# EAGLE design netSpeed (EAGLE 6.3)
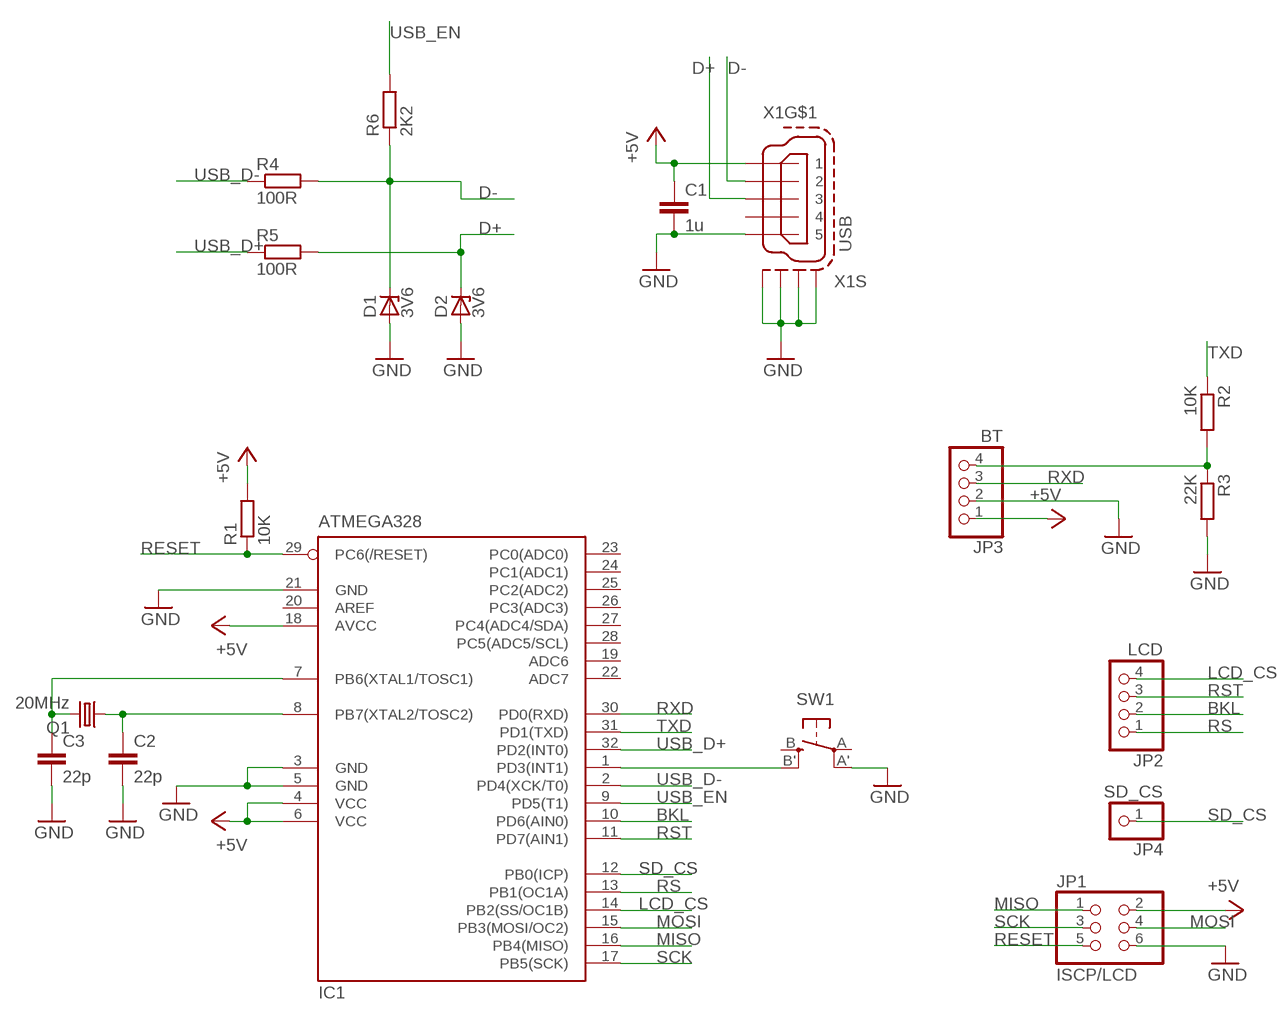
[diagram p0: schematic, sheet 1]

## Parts
C1  1u  C-EUC0805  [C0805]
C2  22p  C-EUC0805  [C0805]
C3  22p  C-EUC0805  [C0805]
D1  3V6  ZENER-DIODEZD-2.5  [ZDIO-2.5]
D2  3V6  ZENER-DIODEZD-2.5  [ZDIO-2.5]
IC1  ATMEGA328  MEGA8-AI  [TQFP32-08]
JP1  ISCP/LCD  PINHD-2X3  [2X03]
JP2  LCD  PINHD-1X4  [1X04]
JP3  BT  PINHD-1X4  [1X04]
JP4  SD_CS  PINHD-1X1  [1X01]
Q1  20MHz  CRYSTALHC49UP  [HC49UP]
R1  10K  R-EU_M0805  [M0805]
R2  10K  R-EU_M0805  [M0805]
R3  22K  R-EU_M0805  [M0805]
R4  100R  R-EU_M0805  [M0805]
R5  100R  R-EU_M0805  [M0805]
R6  2K2  R-EU_M0805  [M0805]
SW1  SPST_TACT-EVQQ2  [EVQ-Q2]
X1  USB  MINI-USB-SCHIELD-32005-201  [32005-201]

## Nets
+5V: C1.1 IC1.4(VCC) IC1.6(VCC) IC1.18(AVCC) JP1.2 JP3.1 R1.2 X1.1
BKL: IC1.10(PD6(AIN0)) JP2.2
D+: D2.C R5.2 X1.3
D-: D1.C R4.2 R6.1 X1.2
GND: C1.2 C2.2 C3.2 D1.A D2.A IC1.3(GND) IC1.5(GND) IC1.21(GND) JP1.6 JP3.2 R3.2 SW1.A'(P1) X1.5 X1.M1(S:S1) X1.M2(S:S2) X1.M3(S:S3) X1.M4(S:S4)
LCD_CS: IC1.14(PB2(SS/OC1B)) JP2.4
MISO: IC1.16(PB4(MISO)) JP1.1
MOSI: IC1.15(PB3(MOSI/OC2)) JP1.4
N$1: IC1.1(PD3(INT1)) SW1.B'(S1)
N$2: JP3.4 R2.2 R3.1
N$4: C2.1 IC1.8(PB7(XTAL2/TOSC2)) Q1.1
N$5: C3.1 IC1.7(PB6(XTAL1/TOSC1)) Q1.2
RESET: IC1.29(PC6(/RESET)) JP1.5 R1.1
RS: IC1.13(PB1(OC1A)) JP2.1
RST: IC1.11(PD7(AIN1)) JP2.3
RXD: IC1.30(PD0(RXD)) JP3.3
SCK: IC1.17(PB5(SCK)) JP1.3
SD_CS: IC1.12(PB0(ICP)) JP4.1
TXD: IC1.31(PD1(TXD)) R2.1
USB_D+: IC1.32(PD2(INT0)) R5.1
USB_D-: IC1.2(PD4(XCK/T0)) R4.1
USB_EN: IC1.9(PD5(T1)) R6.2
Unconnected: IC1.19(ADC6) IC1.20(AREF) IC1.22(ADC7) IC1.23(PC0(ADC0)) IC1.24(PC1(ADC1)) IC1.25(PC2(ADC2)) IC1.26(PC3(ADC3)) IC1.27(PC4(ADC4/SDA)) IC1.28(PC5(ADC5/SCL)) SW1.A(P) SW1.B(S) X1.4

## Library data of the parts
C1-C3 = resistor:C-EU: CAPACITOR, European symbol
D1 D2 = diode:ZENER-DIODE: Z-Diode
IC1 = atmel:MEGA8: MICROCONTROLLER 8 Kbytes FLASH, 1 kbytes SRAM, 512 bytes EEPROM, USART, 6-channel 10 bit ADC, 2-channel 8 bit ADC Pin compatible with Atmega48, ATMega88, ATMega168 Source: avr.lbr; MPN: ATMEGA8-16AU; OC_FARNELL: 9171371; OC_NEWARK: 73M8863
JP1 = pinhead:PINHD-2X3: PIN HEADER
JP2 JP3 = pinhead:PINHD-1X4: PIN HEADER
JP4 = pinhead:PINHD-1X1: PIN HEADER
Q1 = crystal:CRYSTAL: CRYSTAL; OC_FARNELL: unknown; OC_NEWARK: unknown
R1-R6 = resistor:R-EU_: RESISTOR, European symbol
SW1 = adafruit:SPST_TACT: SMT 6mm switch, EVQQ2 series http://www.ladyada.net/library/eagle
X1 = con-cypressindustries:MINI-USB-SCHIELD-: MINI USB-B Conector Source: www.cypressindustries.com; OC_FARNELL: unknown; OC_NEWARK: unknown

## Board
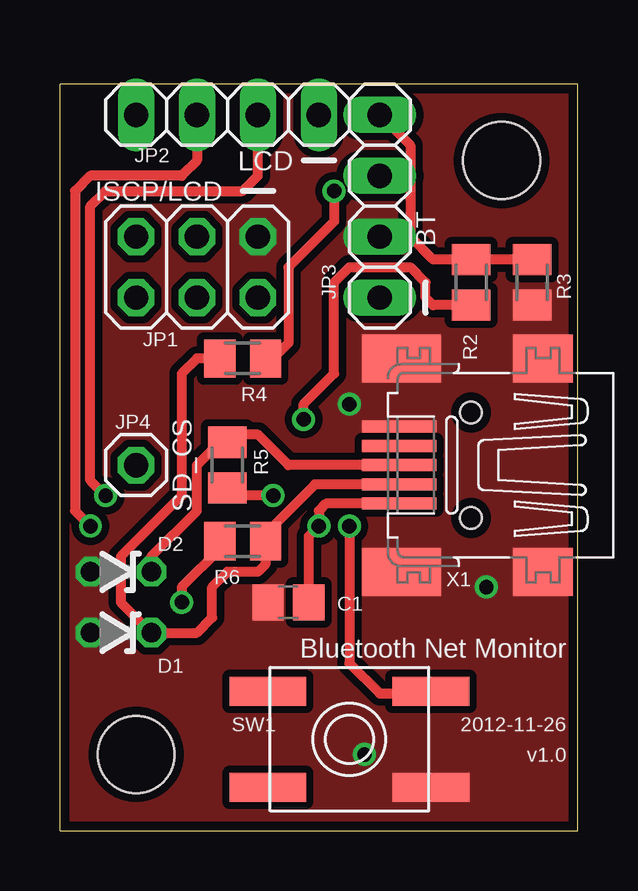
[diagram p1: board, top side]
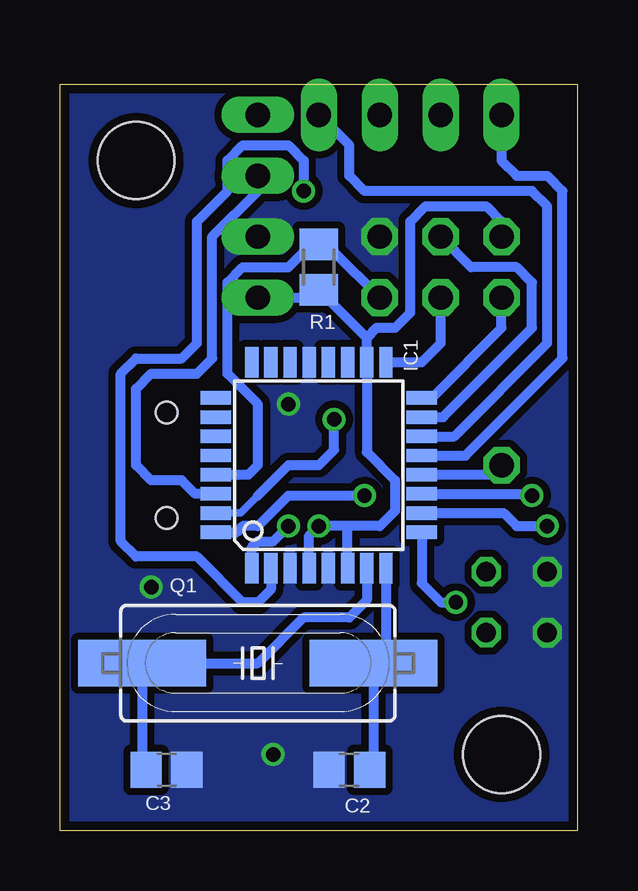
[diagram p2: board, bottom side, seen from below]

Size 21.59 x 31.11 mm. Coordinates in mm from the lower left corner, seen from the top.
Outline: 0,0 21.59,0 21.59,31.11 0,31.11 0,0
Copper layers (1*16): Top 0.0356mm / dielectric 1.5011mm / Bottom 0.0356mm
Design rules "default": minimum track width 6mil, minimum drill 13mil, track to track 6mil, track to pad 6mil, pad to pad 6mil, via to via 6mil, smd to smd 6mil, copper to edge 15mil, drill to drill 6mil, minimum pad ring 7mil, minimum via ring 7mil, stop-mask expansion 4mil, vias tented up to drill 0mil, thermal gap 10mil
Holes 3.2 mm at 18.41,27.94 3.17,3.17

### Footprints (pad centres in the part's own frame; a part is rotated, then mirrored left to right if it is on the bottom)
C0805 = smd 1.3 x 1.5: 1 -0.85,0; 2 0.85,0
ZDIO-2.5 = drill 0.813 octagon: A 1.27,0; C -1.27,0
TQFP32-08 = smd 1.27 x 0.559: 1 -4.293,2.8; 2 -4.293,2; 3 -4.293,1.2; 4 -4.293,0.4; 5 -4.293,-0.4; 6 -4.293,-1.2; 7 -4.293,-2; 8 -4.293,-2.8; 17 4.293,-2.8; 18 4.293,-2; 19 4.293,-1.2; 20 4.293,-0.4; 21 4.293,0.4; 22 4.293,1.2; 23 4.293,2; 24 4.293,2.8 | smd 0.559 x 1.27: 9 -2.8,-4.293; 10 -2,-4.293; 11 -1.2,-4.293; 12 -0.4,-4.293; 13 0.4,-4.293; 14 1.2,-4.293; 15 2,-4.293; 16 2.8,-4.293; 25 2.8,4.293; 26 2,4.293; 27 1.2,4.293; 28 0.4,4.293; 29 -0.4,4.293; 30 -1.2,4.293; 31 -2,4.293; 32 -2.8,4.293
2X03 = drill 1.016 octagon: 1 -2.54,-1.27; 2 -2.54,1.27; 3 0,-1.27; 4 0,1.27; 5 2.54,-1.27; 6 2.54,1.27
1X04 = drill 1.016 long: 1 -3.81,0; 2 -1.27,0; 3 1.27,0; 4 3.81,0
1X01 = drill 1.016 octagon: 1 0,0
HC49UP = smd 5.334 x 1.93: 1 -4.826,0; 2 4.826,0
M0805 = smd 1.3 x 1.6: 1 -0.95,0; 2 0.95,0
EVQ-Q2 = smd 3.2 x 1.2: A -3.4,-2; A' 3.4,-2; B -3.4,2; B' 3.4,2
32005-201 = smd 3.1 x 0.5: 1 3,1.6; 2 3,0.8; 3 3,0; 4 3,-0.8; 5 3,-1.6 | smd 2.5 x 2: M1 -3,-4.45; M2 -3,4.45 | smd 3.3 x 2: M3 2.9,4.45; M4 2.9,-4.45 | hole 0.9: 0,2.2; 0,-2.2

### Placement (x,y rotation side)
C1  9.53,9.53 180 top
C2  9.53,2.54 180 bottom
C3  17.14,2.54 0 bottom
D1  2.54,8.26 180 top
D2  2.54,10.79 180 top
IC1  10.79,15.24 90 bottom
JP1  5.71,23.5 0 top
JP2  6.99,29.84 0 top
JP3  13.34,26.04 90 top
JP4  3.17,15.24 0 top
Q1  13.34,6.99 180 bottom
R1  10.79,23.5 270 bottom
R2  17.14,22.86 90 top
R3  19.68,22.86 270 top
R4  7.62,19.68 180 top
R5  6.99,15.24 90 top
R6  7.62,12.06 180 top
SW1  12.06,3.81 0 top
X1  17.14,15.24 180 top

### Tracks (layer width: path | path; a pad name or v marks a point on that pad's centre or on a via)
+5V  (via drill 0.6)
  Top 0.406: X1.1 11.1,13.64 10.79,13.34 v10.79,12.7 10.38,12.28 C1.1
  Bottom 0.406: IC1.4 11.2,12.3 v10.79,12.7 9.53,12.7 | IC1.6 9.6,12.63 9.53,12.7 | 8.79,20.55 IC1.18 8.79,15.78 7.62,14.61 7.62,13.34 8.26,12.7 9.53,12.7 | 8.79,20.55 R1.2 11.12,22.23 JP3.1 | 8.79,20.55 8.38,20.95 7.62,20.95 6.99,21.59 6.99,25.4 6.35,26.04 3.81,26.04 3.17,25.4 JP1.2
BKL  (via drill 0.6)
  Top 0.406: JP2.2 5.71,27.94 5.08,27.3 1.27,27.3 0.64,26.67 0.64,13.34 v1.27,12.7
  Bottom 0.406: IC1.10 3.08,13.24 2.54,12.7 v1.27,12.7
D+
  Top 0.406: D2.C 3.81,11.43 5.71,13.34 5.71,15.24 6.35,15.88 6.67,15.88 R5.2 7.3,16.51 8.26,16.51 9.53,15.24 X1.3
D-
  Top 0.406: X1.2 10.63,14.44 8.57,12.38 R6.1 8.57,11.11 8.26,10.79 6.99,10.79 6.35,10.16 6.35,8.89 5.71,8.26 D1.C 2.54,9.53 2.54,11.43 5.08,13.97 5.08,19.05 5.71,19.68 R4.2
GND  (via drill 0.6)
  other vias: 17.78,10.16 12.7,3.17 12.06,17.78
  pour Top (isolate 0.305, no thermals): 0,31.11 21.59,31.11 21.59,0 0,0
  pour Bottom (isolate 0.305, no thermals): 0,31.11 21.59,31.11 21.59,0 0,0
LCD_CS
  Bottom 0.406: IC1.14 5.15,16.44 1.27,20.32 1.27,26.04 1.91,26.67 8.89,26.67 9.53,27.3 9.53,28.57 JP2.4
MISO
  Bottom 0.406: IC1.16 6.09,18.04 3.17,20.95 JP1.1
MOSI
  Bottom 0.406: JP1.4 4.45,23.5 2.54,23.5 1.91,22.86 1.91,20.95 5.62,17.24 IC1.15
N$1  (via drill 0.6)
  Top 0.406: v12.06,12.7 12.06,6.99 13.34,5.71 15.37,5.71 SW1.B'
  Bottom 0.406: IC1.1 13.6,11.8 13.34,12.06 12.7,12.06 v12.06,12.7
N$2
  Top 0.406: JP3.4 14.61,28.57 14.61,24.77 15.56,23.81 R2.2 R3.1
N$4
  Bottom 0.406: IC1.8 8,7.5 Q1.1 8.51,2.71 C2.1
N$5
  Bottom 0.406: IC1.7 8.79,9.62 9.53,8.89 11.43,8.89 13.34,6.99 Q1.2 18.16,2.71 C3.1
RESET
  Bottom 0.406: IC1.29 13.73,14.84 13.34,15.24 13.34,17.78 14.61,19.05 14.61,22.86 13.97,23.5 12.06,23.5 11.43,24.13 11.11,24.13 R1.1 10.48,24.13 10.16,24.13 JP1.5
RS
  Bottom 0.406: JP2.1 3.17,27.94 2.54,27.3 1.27,27.3 0.64,26.67 0.64,19.68 4.68,15.64 IC1.13
RST  (via drill 0.6)
  Top 0.406: JP2.3 8.26,27.3 7.62,26.67 1.91,26.67 1.27,26.04 1.27,14.61 v1.91,13.97
  Bottom 0.406: IC1.11 1.98,14.04 v1.91,13.97
RXD
  Bottom 0.406: IC1.30 15.95,14.04 16.51,14.61 17.78,14.61 18.41,15.24 18.41,18.41 17.78,19.05 15.88,19.05 15.24,19.68 15.24,24.77 13.34,26.67 JP3.3
SCK
  Bottom 0.406: IC1.17 6.5,19.53 5.71,20.32 JP1.3
SD_CS
  Bottom 0.406: IC1.12 3.58,14.84 JP4.1
TXD  (via drill 0.6)
  Top 0.406: R2.1 15.55,21.91 15.24,22.23 15.24,22.86 14.61,23.5 12.06,23.5 11.43,22.86 11.43,19.05 10.16,17.78 v10.16,17.14
  Bottom 0.305: IC1.31 14.06,13.24 13.34,13.97
  Bottom 0.406: 13.34,13.97 12.06,15.24 10.79,15.24 10.16,15.88 v10.16,17.14
USB_D+  (via drill 0.6)
  Top 0.406: v8.89,13.97 7.3,13.97 R5.1
  Bottom 0.406: v8.89,13.97 12.06,13.97 13.34,12.7 13.97,12.7 14.23,12.44 IC1.32
USB_D-  (via drill 0.6)
  Top 0.406: v11.43,26.67 11.43,25.4 9.53,23.5 9.53,20.32 8.89,19.68 R4.1
  Bottom 0.406: v11.43,26.67 11.43,27.94 12.06,28.57 13.97,28.57 14.61,27.94 14.61,26.67 15.88,25.4 15.88,20.32 16.51,19.68 18.41,19.68 19.05,19.05 19.05,12.06 18.41,11.43 15.88,11.43 13.97,9.53 13.34,9.53 12.79,10.06 IC1.2
USB_EN  (via drill 0.6)
  Top 0.406: R6.2 6.67,11.75 5.08,10.16 v5.08,9.53
  Bottom 0.406: IC1.9 6.5,10.31 5.71,9.53 v5.08,9.53

### Text on the board
tNames: LCD | ISCP/LCD | BT | SD_CS | Bluetooth Net Monitor | 2012-11-26 | v1.0
bNames: Bluetooth | Net | Monitor